# Altium schematic sheet Sheet1.SchDoc
size A
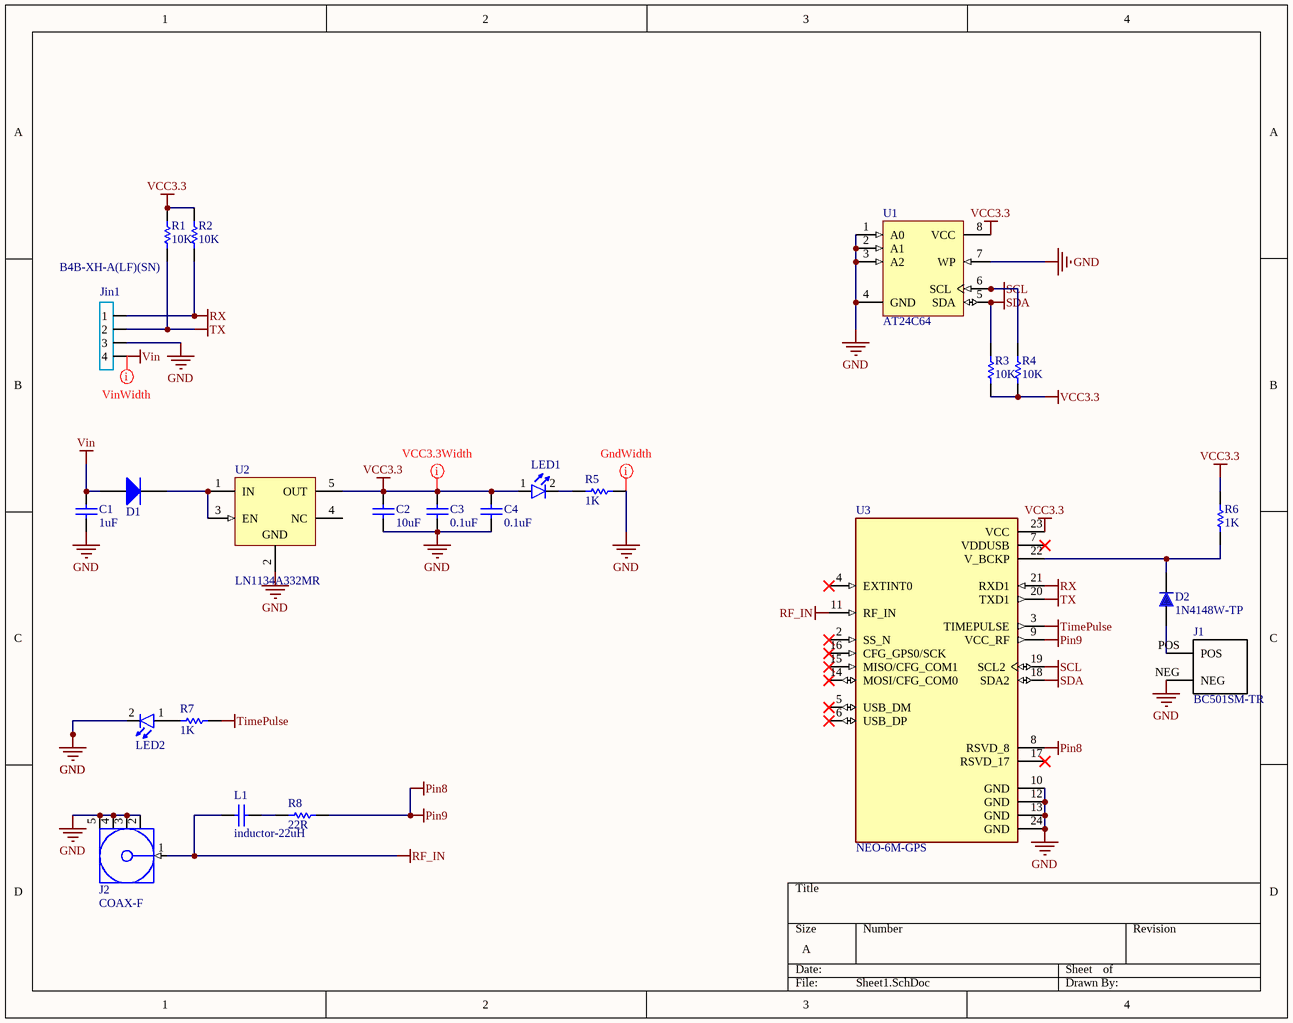
[diagram p0: Sheet1.SchDoc]

## Parts
C1  1uF  [CAPC4817X12N]
C2  10uF  [CAPC4817X12N]
C3  0.1uF  [CAPC4817X12N]
C4  0.1uF  [CAPC4817X12N]
D1  1n4007  [DIOM4629X24N]  (value not drawn)
D2  1N4148W-TP  [SOD123]
J1  BC501SM-TR  [*MPD_BC501SM-TR_BC501SM-TR(Primary)]
J2  COAX-F  [MCX5.08-H5]
Jin1  B4B-XH-A(LF)(SN)  [*JST_B4B-XH-A(LF)(SN)]
L1  inductor-22uH  [IND1206]
LED1  Red  [LED SMD 1206]  (value not drawn)
LED2  Red  [LED SMD 1206]  (value not drawn)
R1  10K  [RESC4817X04N]
R2  10K  [RESC4817X04N]
R3  10K  [RESC4817X04N]
R4  10K  [RESC4817X04N]
R5  1K  [RESC4817X04N]
R6  1K  [RESC4817X04N]
R7  1K  [RESC4817X04N]
R8  22R  [RESC4817X04N]
U1  AT24C64  [8S1_M]
U2  LN1134A332MR  [MF05A_M]
U3  NEO-6M-GPS  [XCVR_NEO-6M-GPS]

## Nets
GND: C1.1 C2.1 C3.1 C4.1 J1.NEG J2.2(GND) J2.3(GND) J2.4(GND) J2.5(GND) Jin1.3 LED2.2(K) R5.2 U1.1(A0) U1.2(A1) U1.3(A2) U1.4(GND) U1.7(WP) U2.2(GND) U3.10(GND) U3.12(GND) U3.13(GND) U3.24(GND)
Pin8: R8.2 U3.8(RSVD_8) U3.9(VCC_RF)  [also labelled Pin9]
RF_IN: J2.1(Signal) L1.1 U3.11(RF_IN)
RX: Jin1.1 R2.1 U3.21(RXD1)
SCL: R4.2 U1.6(SCL) U3.19(SCL2)
SDA: R3.2 U1.5(SDA) U3.18(SDA2)
TimePulse: R7.2 U3.3(TIMEPULSE)
TX: Jin1.2 R1.1 U3.20(TXD1)
VCC3.3: C2.2 C3.2 C4.2 LED1.1(A) R1.2 R2.2 R3.1 R4.1 R6.2 U1.8(VCC) U2.5(OUT) U3.23(VCC)
Vin: C1.2 D1.1(A) Jin1.4
NetD1_2: D1.2(K) U2.1(IN) U2.3(EN)
NetD2_1: D2.1 J1.POS
NetD2_2: D2.2 R6.1 U3.22(V_BCKP)
NetL1_2: L1.2 R8.1
NetLED1_2: LED1.2(K) R5.1
NetLED2_1: LED2.1(A) R7.1

Not connected (* = marked no-connect by the designer): U2 4(NC); U3 2(SS_N)* 4(EXTINT0)* 5(USB_DM)* 6(USB_DP)* 7(VDDUSB)* 14(MOSI/CFG_COM0)* 15(MISO/CFG_COM1)* 16(CFG_GPS0/SCK)* 17(RSVD_17)*

## Layout directives
rule Width Constraint [Pref Width = 1.5mm    Min Width = 0.5mm    Max Width = 3mm]: VCC3.3, Vin
rule Width Constraint [Pref Width = 1.5mm    Min Width = 0.3mm    Max Width = 3mm]: GND

## Library data of the parts
C1-C4 = CAP SMD 1206: CAP 1206; Designer: Abbas Basereh; Desc.: CAP SMD 1206; Data: 16-12-2016
D1 = 1n4007 SMD M7: Standard Rectifiers; Part. No: M7; Manufacturer: DC COMPONENTS; Designer: Abbas Basereh; Link: http://www.tme.eu/en/details/m7/smd-universal-diodes/dc-components/; Link: https://www.aliexpress.com/item/Smd-tube-1n4007-m7-SMA/1213719741.html?spm=2114.01010208.3.1.ZyZ7bC&ws_ab_test=searchweb0_0,searchweb201602_4_10065_10068_10084_10083_10080_10082_10081_10060_10061_10062_10056_10055_10054_10059_10099_10078_10079_427_10073_10103_10102_10096_10052_10050_10051,searchweb201603_4&btsid=db2be5ca-e560-400a-b91c-484ab5ee228b; Data: 16-12-2016
D2 = 1N4148W-TP: DIODE GEN PURP 100V 150MA SOD123; Published: 2017-1-12; PackageVersion: 2017-1-12; PackageReference: SOD-123; Publisher: Abbas Basereh; PackageDescription: Diode Standard 100V 150mA Surface Mount SOD-123; ComponentLink1Description: Manufacturer Link; ComponentLink1URL: http://www.digikey.com/product-detail/en/micro-commercial-co/1N4148W-TP/1N4148WTPMSCT-ND/717311; ComponentLink2Description: Datasheet; PART.NO: 1N4148W-TP
J2 = COAX-F: RF Coaxial PCB Connector, MCX; Thru-Hole, Right-Angle Mount Socket, Blunt Post Terminal, 50 Ohm Impedance; PCB_Layout: Complies with manufacturer's recommendation.; DrillSize: Corresponds to nominal value.; Published: 15-Jul-2004; LatestRevisionDate: 15-Jul-2004; LatestRevisionNote: Component Replaced.; DatasheetDocument: 30-May-2003; PackageDocument: 04-Jul-1999; PackageReference: 919-119J-51AX; Publisher: Altium Limited; ComponentLink1Description: Manufacturer Link; ComponentLink1URL: http://www.amphenolrf.com/
Jin1 = B4B-XH-A(LF)(SN): XH Series 4 Position 2.5 mm Pitch Through Hole Crimp Top Entry Shrouded Header; MF: JST Sales; MP: B4B-XH-A_LF__SN_; Package: None; Price: None; SnapEDA_Link: https://www.snapeda.com/parts/B4B-XH-A%28LF%29%28SN%29/JST%20Sales%20America%20Inc./view-part/?ref=snap; Availability: Unavailable; Value: *
L1 = INDUCTOR SMD PACKAGE: TOTAL INDUCTOR SMD PACK; Designer: Abbas Basereh; Desc.: INDUCTOR  SMD TOTAL PACKAGES; Data: 2017-3-10
LED1 LED2 = LED: Designer: Saeid Jorablo; Organazation: ControTec; Adding Date: 1387/12/22; Color: Red; Size: SMD 1206
R1-R8 = RES 1206 0.25W: RES 1206; Designer: Abbas Basereh; Desc.: RES SMD 1206; Data: 16-12-2016
U1 = AT24C01BN-SP25-B: 1Kbit (128 x 8), 2-wire Bus Automotive Serial EEPROM with Write Protect, 2.5V, 8-Pin SOIC, Bulk; DatasheetVersion: 8517C,  Jan-2009; PackageVersion: revC, Mar-2005; PackageReference: 8S1; PackageDescription: 8-Lead (0.150" Wide Body), Plastic Gull Wing Small Outline (JEDEC SOIC); Code_JEDEC: MS-012-AA; Code_IPC: SOIC127P600-8; ComponentLink1Description: Manufacturer URL; ComponentLink1URL: http://www.atmel.com/; ComponentLink2Description: Datasheet; ComponentLink2URL: http://www.atmel.com/dyn/resources/prod_documents/doc8517.pdf
U2 = LP5951MF-1.3: Micropower, 150mA Low-Dropout CMOS Voltage Regulator, 5-pin SOT-23; Manufacturer: National Semiconductor; PackageTopMarking: LKRB*XTT; PowerWise: N; CompType: LDO IC; Published: 4-Dec-2008; DatasheetVersion: May-2007; PackageVersion: revD, Aug-2008; PackageReference: MF05A; Publisher: Altium Limited; PackageDescription: Molded SOT-23, .115 x .063 x .040 in Body, 5 Lead, .0375 in Pitch; Supplier 1: Farnell; Supplier Part Number 1: 1312651; PartNumber: LP5951MF-1.3; RoHS: N; PinCount: 5; ComponentLink1Description: LP5951 Datasheet; ComponentLink1URL: http://www.national.com/ds/LP/LP5951.pdf; ComponentLink2Description: LP5951 Web Page; ComponentLink2URL: http://www.national.com/pf/LP/LP5951.html; ComponentLink3Description: MF05A Package Page; ComponentLink3URL: http://www.national.com/packaging/folders/mf05a.html
U3 = NEO-6M-GPS: SMD GPS Module;; MF: u-blox; Availability: Unavailable; MP: NEO-6M-GPS; Package: None; SnapEDA_Link: https://www.snapeda.com/parts/NEO-6M-GPS/u-blox/view-part/105879/?ref=snap; Value: *; Price: None
J1 = BC501SM-TR: SnapEDA_Link: https://www.snapeda.com/parts/BC501SM-TR/MPD%20%28Memory%20Protection%20Devices%29/view-part/479427/?ref=snap; Value: *